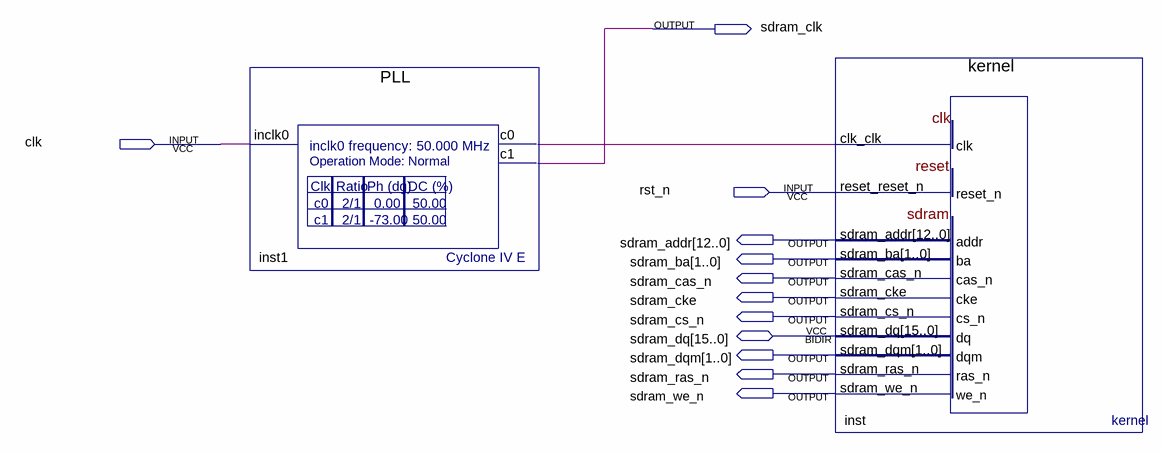
[diagram p0: schematic sheet]
// Quartus schematic top_level.bdf as structural Verilog: 2 symbols, 12 pins
module top_level (
  input  clk,
  input  rst_n,
  inout  [15:0] sdram_dq,
  output sdram_clk,
  output [12:0] sdram_addr,
  output [1:0] sdram_ba,
  output sdram_cas_n,
  output sdram_cke,
  output sdram_cs_n,
  output [1:0] sdram_dqm,
  output sdram_ras_n,
  output sdram_we_n
);

  wire inst1_c0;

  PLL inst1 (.inclk0(clk), .c0(inst1_c0), .c1(sdram_clk));
  kernel inst (
    .clk_clk(inst1_c0), .reset_reset_n(rst_n), .sdram_addr(sdram_addr), .sdram_ba(sdram_ba),
    .sdram_cas_n(sdram_cas_n), .sdram_cke(sdram_cke), .sdram_cs_n(sdram_cs_n), .sdram_dqm(sdram_dqm),
    .sdram_ras_n(sdram_ras_n), .sdram_we_n(sdram_we_n), .sdram_dq(sdram_dq));
endmodule
